# EAGLE design main w vias (EAGLE 9.5.0)
AUTHOR: Josh Castle/Kylie Fernandez; BOARD_NAME: Main Board; DOC_NUM: 1; PROJECT_NAME: Plantiful Care; REVISION: 1

## Sheet 1 of 3: Microcontroller
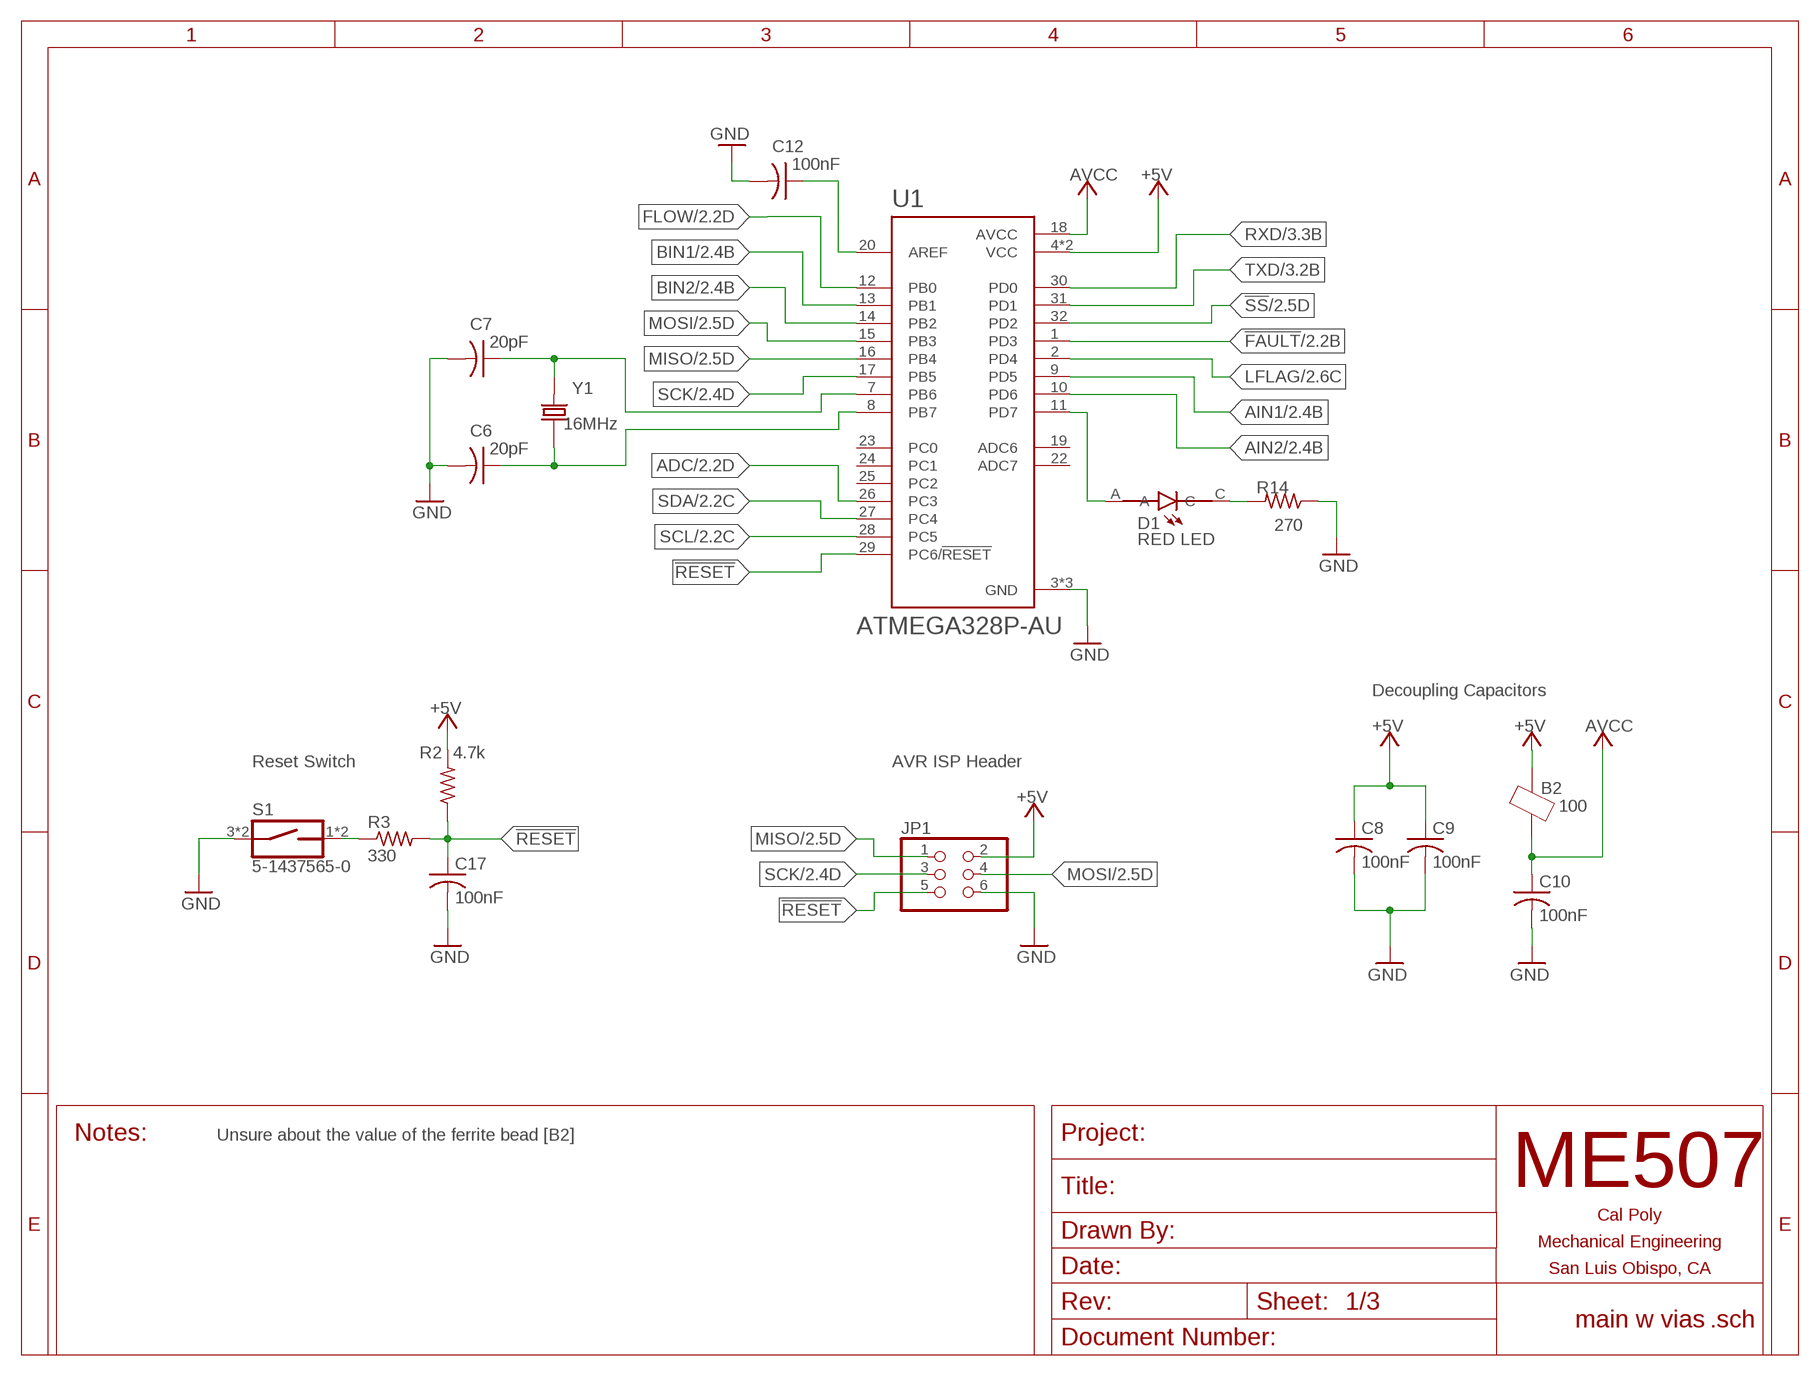
[diagram p0: schematic, sheet 1]

### Parts
B2  100  BEAD0805  [0805]
C6  20pF  C-USC0805  [C0805]
C7  20pF  C-USC0805  [C0805]
C8  100nF  C-USC0805  [C0805]
C9  100nF  C-USC0805  [C0805]
C10  100nF  C-USC0805  [C0805]
C12  100nF  C-USC0805  [C0805]
C17  100nF  C-USC0805  [C0805]
D1  RED LED  HSMC-C190  [LEDM1608X80]
JP1  PINHD-2X3  [2X03]
R2  4.7k  R-US_R0805  [R0805]
R3  330  R-US_R0805  [R0805]
R14  270  R-US_R0805  [R0805]
S1  5-1437565-0  [SW_5-1437565-0]
U1  ATMEGA328P-AU  [QFP80P900X900X120-32N]
Y1  16MHz  ECS-160-20-3X-TR  [XTAL_ECS-160-20-3X-TR]

### Nets
!FAULT!: U1.1(PD3) ; also sheet 2
!RESET!: C17.1 JP1.5 R2.1 R3.2 U1.29(PC6/!RESET)
!SS!: U1.32(PD2) ; also sheet 2
+5V: B2.2 C8.1 C9.1 JP1.2 R2.2 U1.4(VCC) U1.6(VCC) ; also sheet 2,3
ADC: U1.26(PC3) ; also sheet 2
AIN1: U1.9(PD5) ; also sheet 2
AIN2: U1.10(PD6) ; also sheet 2
AREF: C12.1 U1.20(AREF)
AVCC: B2.1 C10.1 U1.18(AVCC)
BIN1: U1.13(PB1) ; also sheet 2
BIN2: U1.14(PB2) ; also sheet 2
FLOW: U1.12(PB0) ; also sheet 2
GND: C6.2 C7.2 C8.2 C9.2 C10.2 C12.2 C17.2 JP1.6 R14.1 S1.3 S1.4 U1.3(GND) U1.5(GND) U1.21(GND) ; also sheet 2,3
LED: D1.C R14.2
LFLAG: U1.2(PD4) ; also sheet 2
MISO: JP1.1 U1.16(PB4) ; also sheet 2
MOSI: JP1.4 U1.15(PB3) ; also sheet 2
PD7: D1.A U1.11(PD7)
RXD: U1.30(PD0) ; also sheet 3
SCK: JP1.3 U1.17(PB5) ; also sheet 2
SCL: U1.28(PC5) ; also sheet 2
SDA: U1.27(PC4) ; also sheet 2
SW: R3.1 S1.1 S1.2
TOSC1: C7.1 U1.7(PB6) Y1.2
TOSC2: C6.1 U1.8(PB7) Y1.1
TXD: U1.31(PD1) ; also sheet 3
Unconnected: U1.19(ADC6) U1.22(ADC7) U1.23(PC0) U1.24(PC1) U1.25(PC2)

### Notes on the sheet
- Decoupling Capacitors
- Reset Switch | AVR ISP Header
- Unsure about the value of the ferrite bead [B2]

## Sheet 2 of 3: Motor Driver
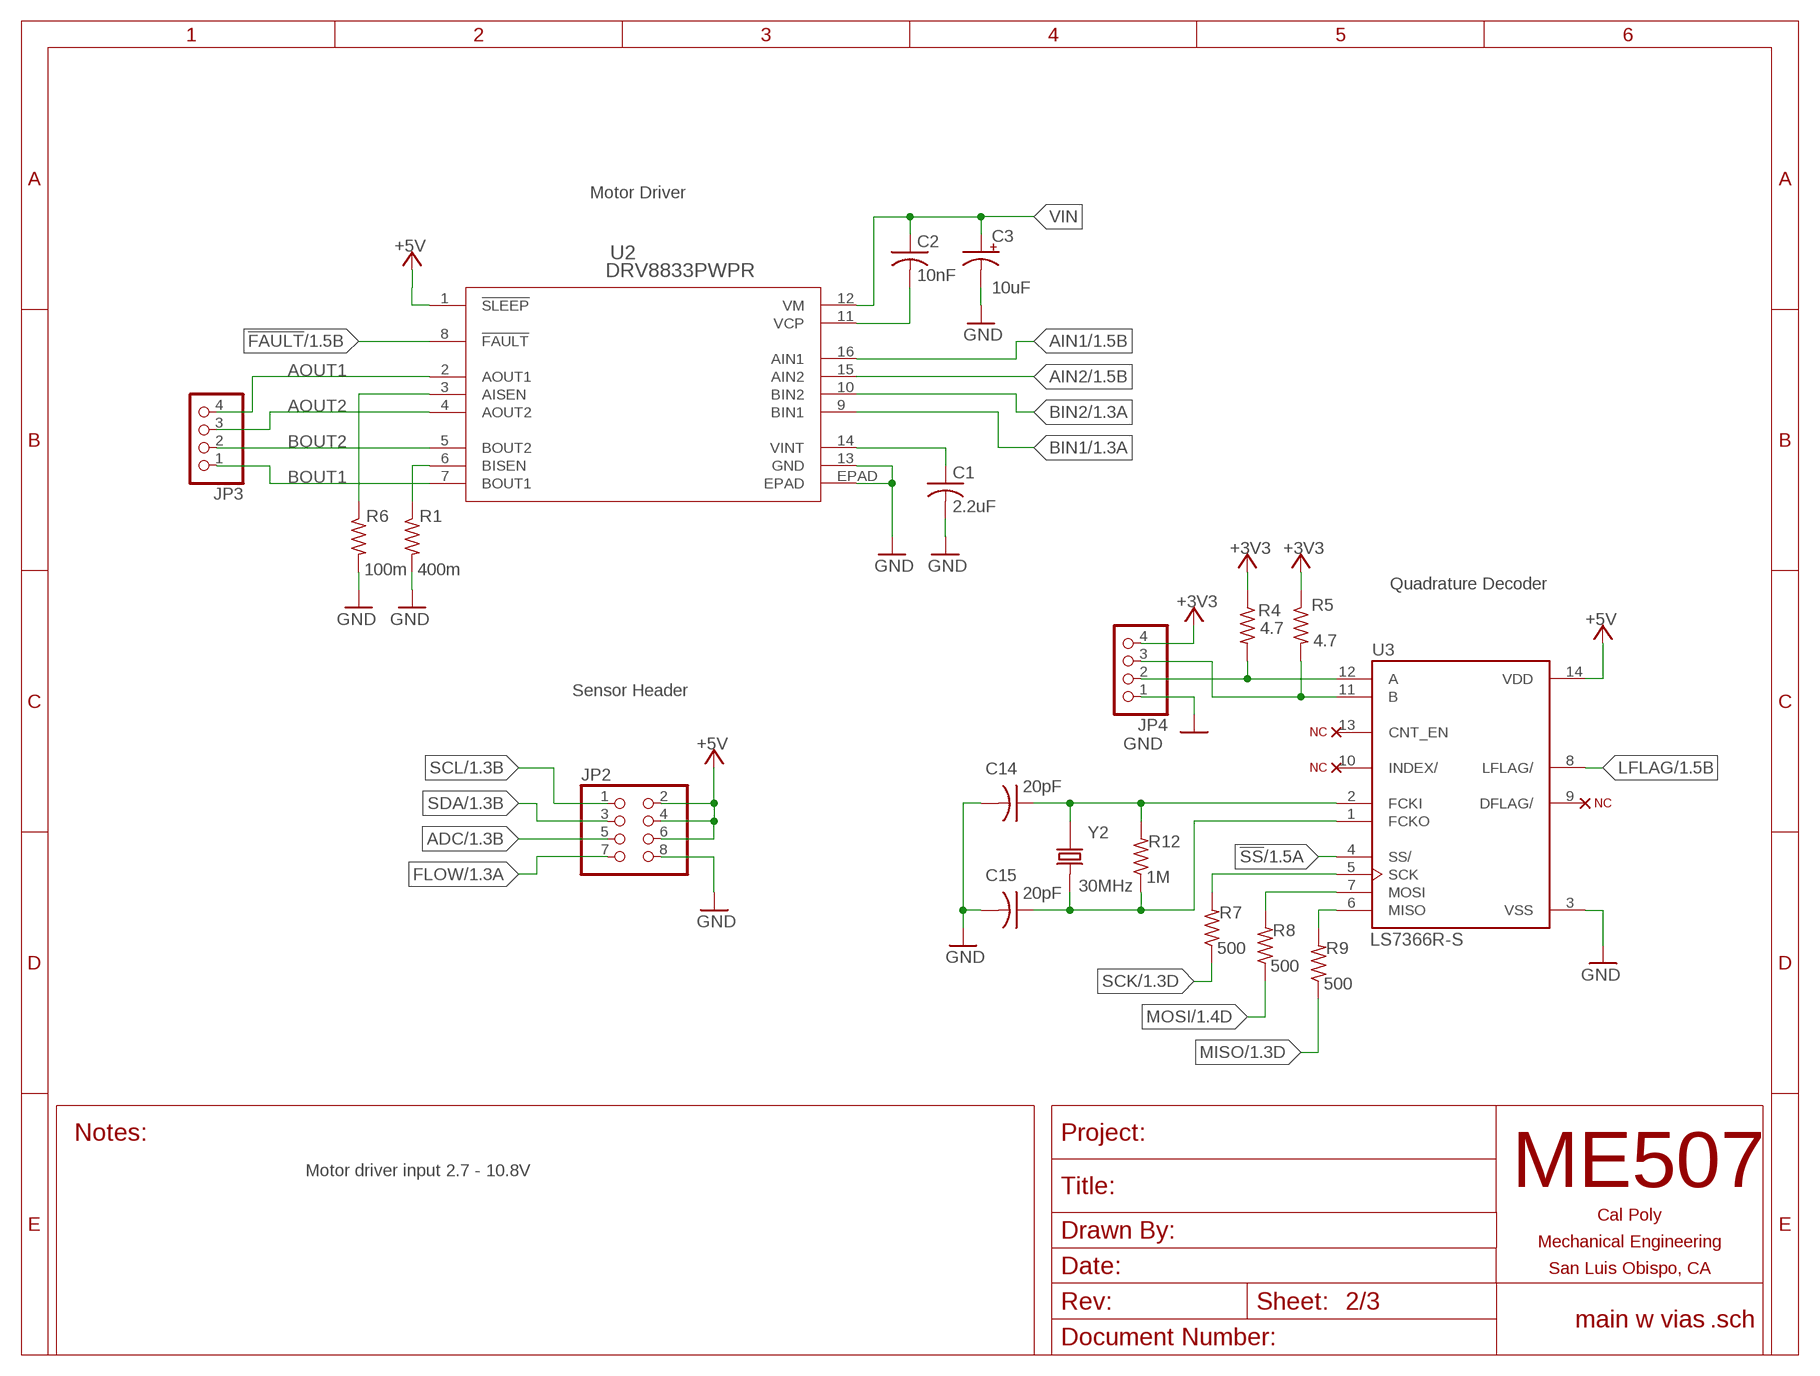
[diagram p1: schematic, sheet 2]

### Parts
C1  2.2uF  C-USC0805  [C0805]
C2  10nF  C-USC0805  [C0805]
C3  10uF  CPOL-USE5-4  [E5-4]
C14  20pF  C-USC0805  [C0805]
C15  20pF  C-USC0805  [C0805]
JP2  PINHD-2X4  [2X04]
JP3  PINHD-1X4  [1X04]
JP4  PINHD-1X4  [1X04]
R1  400m  R-US_R0805  [R0805]
R4  4.7  R-US_R0805  [R0805]
R5  4.7  R-US_R0805  [R0805]
R6  100m  R-US_R0805  [R0805]
R7  500  R-US_R0805  [R0805]
R8  500  R-US_R0805  [R0805]
R9  500  R-US_R0805  [R0805]
R12  1M  R-US_R0805  [R0805]
U2  DRV8833PWPR  [PWP16_2P31X2P46]
U3  LS7366R-S  LS7366R-TSLS7366R-S  [SOIC127P600X175-14N]
U$12  NC  (no package)
U$13  NC  (no package)
U$16  NC  (no package)
Y2  30MHz  ECS-160-20-3X-TR  [XTAL_ECS-160-20-3X-TR]

### Nets
!FAULT!: U2.8(!FAULT!) ; also sheet 1
!SS!: U3.4(SS/) ; also sheet 1
+3V3: JP4.4 R4.1 R5.1 ; also sheet 3
+5V: JP2.2 JP2.4 JP2.6 U2.1(!SLEEP!) U3.14(VDD) ; also sheet 1,3
ADC: JP2.5 ; also sheet 1
AIN1: U2.16(AIN1) ; also sheet 1
AIN2: U2.15(AIN2) ; also sheet 1
AISEN: R6.1 U2.3(AISEN)
AOUT1: JP3.4 U2.2(AOUT1)
AOUT2: JP3.3 U2.4(AOUT2)
BIN1: U2.9(BIN1) ; also sheet 1
BIN2: U2.10(BIN2) ; also sheet 1
BISEN: R1.1 U2.6(BISEN)
BOUT1: JP3.1 U2.7(BOUT1)
BOUT2: JP3.2 U2.5(BOUT2)
ENCA: JP4.2 R4.2 U3.12(A)
ENCB: JP4.3 R5.2 U3.11(B)
FCKI: C14.1 R12.2 U3.2(FCKI) Y2.1
FCKO: C15.1 R12.1 U3.1(FCKO) Y2.2
FLOW: JP2.7 ; also sheet 1
GND: C1.2 C3.- C14.2 C15.2 JP2.8 JP4.1 R1.2 R6.2 U2.13(GND) U2.EPAD U3.3(VSS) ; also sheet 1,3
LFLAG: U3.8(LFLAG/) ; also sheet 1
MI: R9.2 U3.6(MISO)
MISO: R9.1 ; also sheet 1
MO: R8.2 U3.7(MOSI)
MOSI: R8.1 ; also sheet 1
N$4: U3.13(CNT_EN) U$16.D
N$27: U3.10(INDEX/) U$12.D
N$28: U3.9(DFLAG/) U$13.D
SCK: R7.1 ; also sheet 1
SCL: JP2.1 ; also sheet 1
SCLK: R7.2 U3.5(SCK)
SDA: JP2.3 ; also sheet 1
VCP: C2.2 U2.11(VCP)
VIN: C2.1 C3.+ U2.12(VM) ; also sheet 3
VINT: C1.1 U2.14(VINT)

### Notes on the sheet
- Motor Driver
- Quadrature Decoder
- Sensor Header
- Motor driver input 2.7 - 10.8V

## Sheet 3 of 3: USB to UART
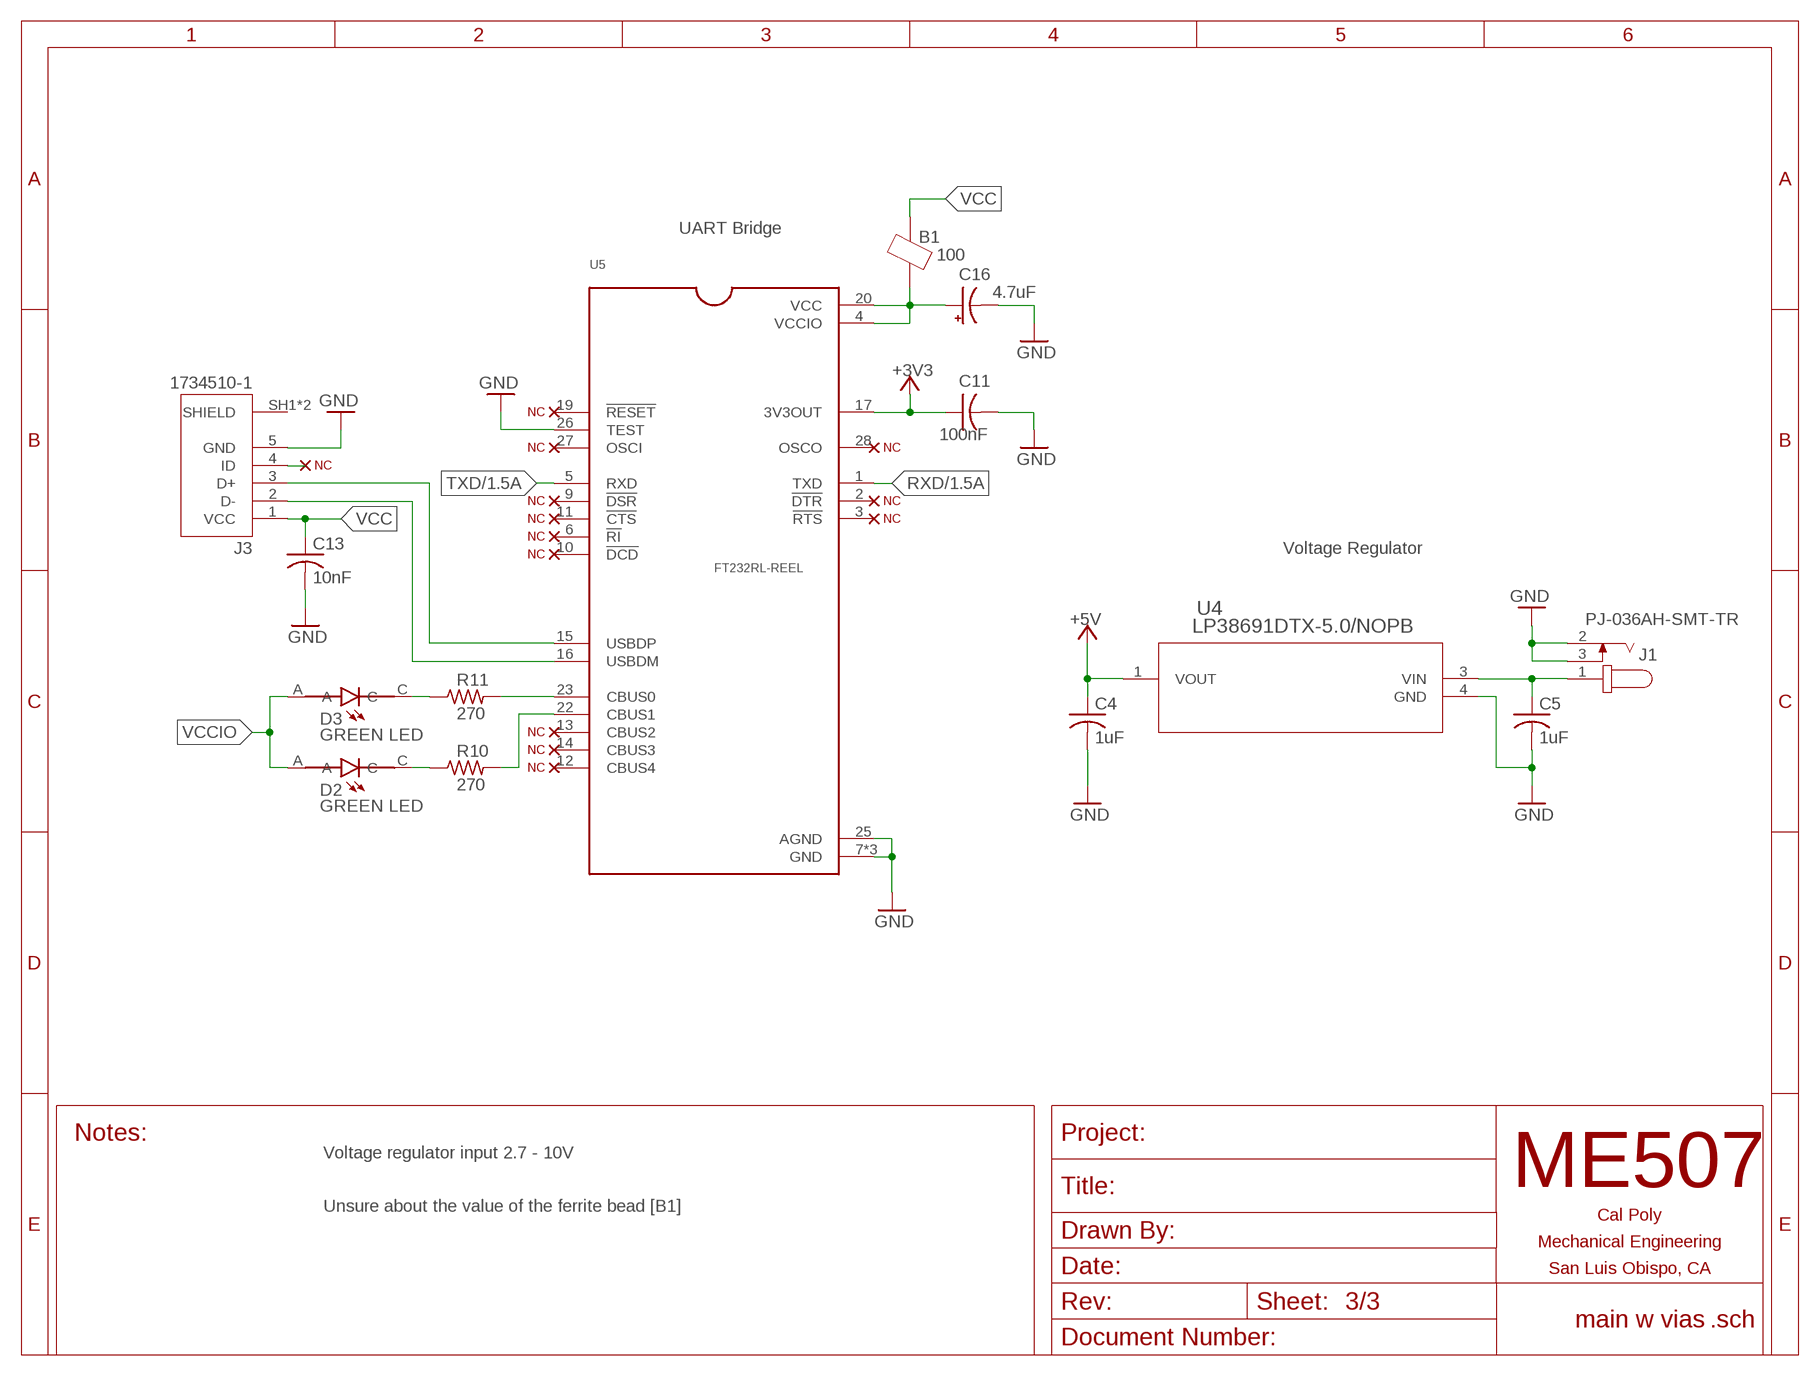
[diagram p2: schematic, sheet 3]

### Parts
B1  100  BEAD0805  [0805]
C4  1uF  C-USC0805  [C0805]
C5  1uF  C-USC0805  [C0805]
C11  100nF  C-USC0805  [C0805]
C13  10nF  C-USC0805  [C0805]
C16  4.7uF  CPOL-USE5-5  [E5-5]
D2  GREEN LED  HSMC-C190  [LEDM1608X80]
D3  GREEN LED  HSMC-C190  [LEDM1608X80]
J1  PJ-036AH-SMT-TR  [CUI_PJ-036AH-SMT-TR]
J3  1734510-1  [TE_1734510-1]
R10  270  R-US_R0805  [R0805]
R11  270  R-US_R0805  [R0805]
U4  LP38691DTX-5.0/NOPB  [TD03B]
U5  FT232RL-REEL  [SOP65P780X200-28N]
U$1  NC  (no package)
U$2  NC  (no package)
U$3  NC  (no package)
U$4  NC  (no package)
U$5  NC  (no package)
U$6  NC  (no package)
U$7  NC  (no package)
U$8  NC  (no package)
U$9  NC  (no package)
U$10  NC  (no package)
U$11  NC  (no package)
U$14  NC  (no package)
U$15  NC  (no package)

### Nets
+3V3: C11.1 U5.17(3V3OUT) ; also sheet 2
+5V: C4.1 U4.1(VOUT) ; also sheet 1,2
BUS0: R11.2 U5.23(CBUS0)
BUS1: R10.2 U5.22(CBUS1)
DM: J3.2(D-) U5.16(USBDM)
DP: J3.3(D+) U5.15(USBDP)
GND: C4.2 C5.2 C11.2 C13.2 C16.- J1.2 J1.3 J3.5(GND) U4.4(GND) U5.7(GND) U5.18(GND) U5.21(GND) U5.25(AGND) U5.26(TEST) ; also sheet 1,2
N$2: U5.3(!RTS) U$14.D
N$3: U5.11(!CTS) U$15.D
N$12: J3.4(ID) U$1.D
N$16: U5.27(OSCI) U$2.D
N$17: U5.28(OSCO) U$3.D
N$18: U5.19(!RESET) U$4.D
N$20: U5.9(!DSR) U$5.D
N$21: U5.6(!RI) U$6.D
N$22: U5.10(!DCD) U$7.D
N$23: U5.2(!DTR) U$8.D
N$24: U5.13(CBUS2) U$9.D
N$25: U5.14(CBUS3) U$10.D
N$26: U5.12(CBUS4) U$11.D
RXD: U5.1(TXD) ; also sheet 1
RXLED: D2.C R10.1
TXD: U5.5(RXD) ; also sheet 1
TXLED: D3.C R11.1
VCC: B1.2 C13.1 J3.1(VCC)
VCCIO: B1.1 C16.+ D2.A D3.A U5.4(VCCIO) U5.20(VCC)
VIN: C5.1 J1.1 U4.3(VIN) ; also sheet 2
Unconnected: J3.SH1(SHIELD) J3.SH2(SHIELD)

### Notes on the sheet
- UART Bridge
- Voltage Regulator
- Voltage regulator input 2.7 - 10V
- Unsure about the value of the ferrite bead [B1]

## Library data of the parts
B1 B2 = ME507:BEAD: Ferrite Bead
C1 C2 C4-C15 C17 = rcl:C-US: CAPACITOR, American symbol; SPICEPREFIX: C
C3 C16 = rcl:CPOL-US: POLARIZED CAPACITOR, American symbol; SPICEPREFIX: C
D1-D3 = HSMC-C190:HSMC-C190: LED, SMD, RED; DESCRIPTION: LED; SMD; 0603; red; 28.5-90mcd; 1.6x0.8x0.8mm; 170°; 1.9÷2.4V; 20mA; DIGI-KEY_PART_NUMBER: 516-1421-1-ND; DIGI-KEY_PURCHASE_URL: https://www.digikey.com/product-detail/en/broadcom-limited/HSMC-C190/516-1421-1-ND/637745?utm_source=snapeda&utm_medium=aggregator&utm_campaign=symbol; MF: Broadcom Limited; MP: HSMC-C190; PACKAGE: 0603 Broadcom
J1 = Downloads:PJ-036AH-SMT-TR: 2.0 mm Center Pin, 5.0 A, Right Angle, Surface Mount (SMT), Dc Power Jack Connector; CUI_PURCHASE_URL: https://www.cuidevices.com/product/interconnect/connectors/dc-power-connectors/jacks/pj-036ah-smt-tr?utm_source=snapeda.com&utm_medium=referral&utm_campaign=snapedaBOM; DESCRIPTION: 2.0 x 6.3 mm, 5.0 A, Horizontal, Surface Mount _SMT_, Dc Power Jack Connector; DIGI-KEY_PART_NUMBER: CP-036AHPJCT-ND; DIGI-KEY_PURCHASE_URL: https://www.digikey.com/product-detail/en/cui-devices/PJ-036AH-SMT-TR/CP-036AHPJCT-ND/1530994?utm_source=snapeda&utm_medium=aggregator&utm_campaign=symbol; MF: CUI Devices; MP: PJ-036AH-SMT-TR; PACKAGE: None
J3 = Downloads:1734510-1: Conn Mini USB Type B RCP 5 POS 1.6mm Solder RA Thru-Hole 5 Terminal 1 Port Tray; COMMENT: 1734510-1; DESCRIPTION: Conn Mini USB Type B RCP 5 POS 1.6mm Solder RA Thru-Hole 5 Terminal 1 Port Tray; DIGI-KEY_PART_NUMBER: A107788-ND; DIGI-KEY_PURCHASE_URL: https://www.digikey.com/product-detail/en/te-connectivity-amp-connectors/1734510-1/A107788-ND/4021669?utm_source=snapeda&utm_medium=aggregator&utm_campaign=symbol; MF: TE Connectivity; MP: 1734510-1; PACKAGE: None; TE_PURCHASE_URL: https://www.te.com/usa-en/product-1734510-1.html?te_bu=Cor&te_type=disp&te_campaign=seda_glo_cor-seda-global-disp-prtnr-fy19-seda-model-bom-cta_sma-317_1&elqCampaignId=32493
JP1 = pinhead:PINHD-2X3: PIN HEADER
JP2 = Downloads:PINHD-2X4: PIN HEADER
JP3 JP4 = Downloads:PINHD-1X4: PIN HEADER
R1-R12 R14 = rcl:R-US_: RESISTOR, American symbol; SPICEPREFIX: R
S1 = Downloads:5-1437565-0: Switch Tactile OFF (ON) Round Button Gull Wing 0.05A 12VDC 1.57N SMD T/R; COMMENT: 5-1437565-0; DESCRIPTION: Switch Push Button N.O. SPST Round Button 0.05A 12VDC 1VA Alternate Contact Gull Wing SMD T/R; DIGI-KEY_PART_NUMBER: 450-2058-1-ND; DIGI-KEY_PURCHASE_URL: https://www.digikey.com/product-detail/en/te-connectivity-alcoswitch-switches/FSM6JSMATR/450-2058-1-ND/4569748?utm_source=snapeda&utm_medium=aggregator&utm_campaign=symbol; MF: TE Connectivity; MP: FSM6JSMATR; PACKAGE: None; TE_PURCHASE_URL: https://www.te.com/usa-en/product-5-1437565-0.html?te_bu=Cor&te_type=disp&te_campaign=seda_glo_cor-seda-global-disp-prtnr-fy19-seda-model-bom-cta_sma-317_1&elqCampaignId=32493
U1 = Downloads:ATMEGA328P-AU: ATmega Series 20 MHz 32 KB Flash 2 KB SRAM 8-Bit Microcontroller - TQFP-32; DESCRIPTION: Microcontroller Mcu, 8 Bit, Atmega, 20mhz, Tqfp-32; DIGI-KEY_PART_NUMBER: ATMEGA328P-AU-ND; DIGI-KEY_PURCHASE_URL: https://www.digikey.com/product-detail/en/microchip-technology/ATMEGA328P-AU/ATMEGA328P-AU-ND/1832260?utm_source=snapeda&utm_medium=aggregator&utm_campaign=symbol; MF: Microchip; MP: ATMEGA328P-AU; PACKAGE: TQFP-32 Microchip
U2 = Downloads:DRV8833PWPR; MANUFACTURER_PART_NUMBER: DRV8833PWPR; VENDOR: Texas Instruments
U3 = Downloads:LS7366R-TS: 32-BIT QUADRATURE COUNTER WITH SERIAL INTERFACE
U4 = Downloads:LP38691DTX-5.0/NOPB; MANUFACTURER_PART_NUMBER: LP38691DTX5.0NOPB; VENDOR: Texas Instruments
U5 = Downloads:FT232RL-REEL: USB to serial UART interface; DESCRIPTION: USB Full Speed to Serial UART IC, Includes Oscillator and EEPROM - SSOP-28; DIGI-KEY_PART_NUMBER: 768-1007-1-ND; DIGI-KEY_PURCHASE_URL: https://www.digikey.com/product-detail/en/ftdi-future-technology-devices-international-ltd/FT232RL-REEL/768-1007-1-ND/1836402?utm_source=snapeda&utm_medium=aggregator&utm_campaign=symbol; MF: FTDI,; MP: FT232RL-REEL; PACKAGE: SSOP-28 FTDI
U$1-U$16 = ME507:NC
Y1 Y2 = Downloads:ECS-160-20-3X-TR: SMD QUARTZ CRYSTAL; DESCRIPTION: CSM-3X Series 16 MHz ±30 ppm 20 pF -10 to +70 °C Surface Mount Quartz Crystal; DIGI-KEY_PART_NUMBER: XC1776CT-ND; DIGI-KEY_PURCHASE_URL: https://www.digikey.com/product-detail/en/ecs-inc/ECS-160-20-3X-TR/XC1776CT-ND/2676640?utm_source=snapeda&utm_medium=aggregator&utm_campaign=symbol; MF: ECS Inc.; MP: ECS-160-20-3X-TR; PACKAGE: HC49/US ECS International

## Board
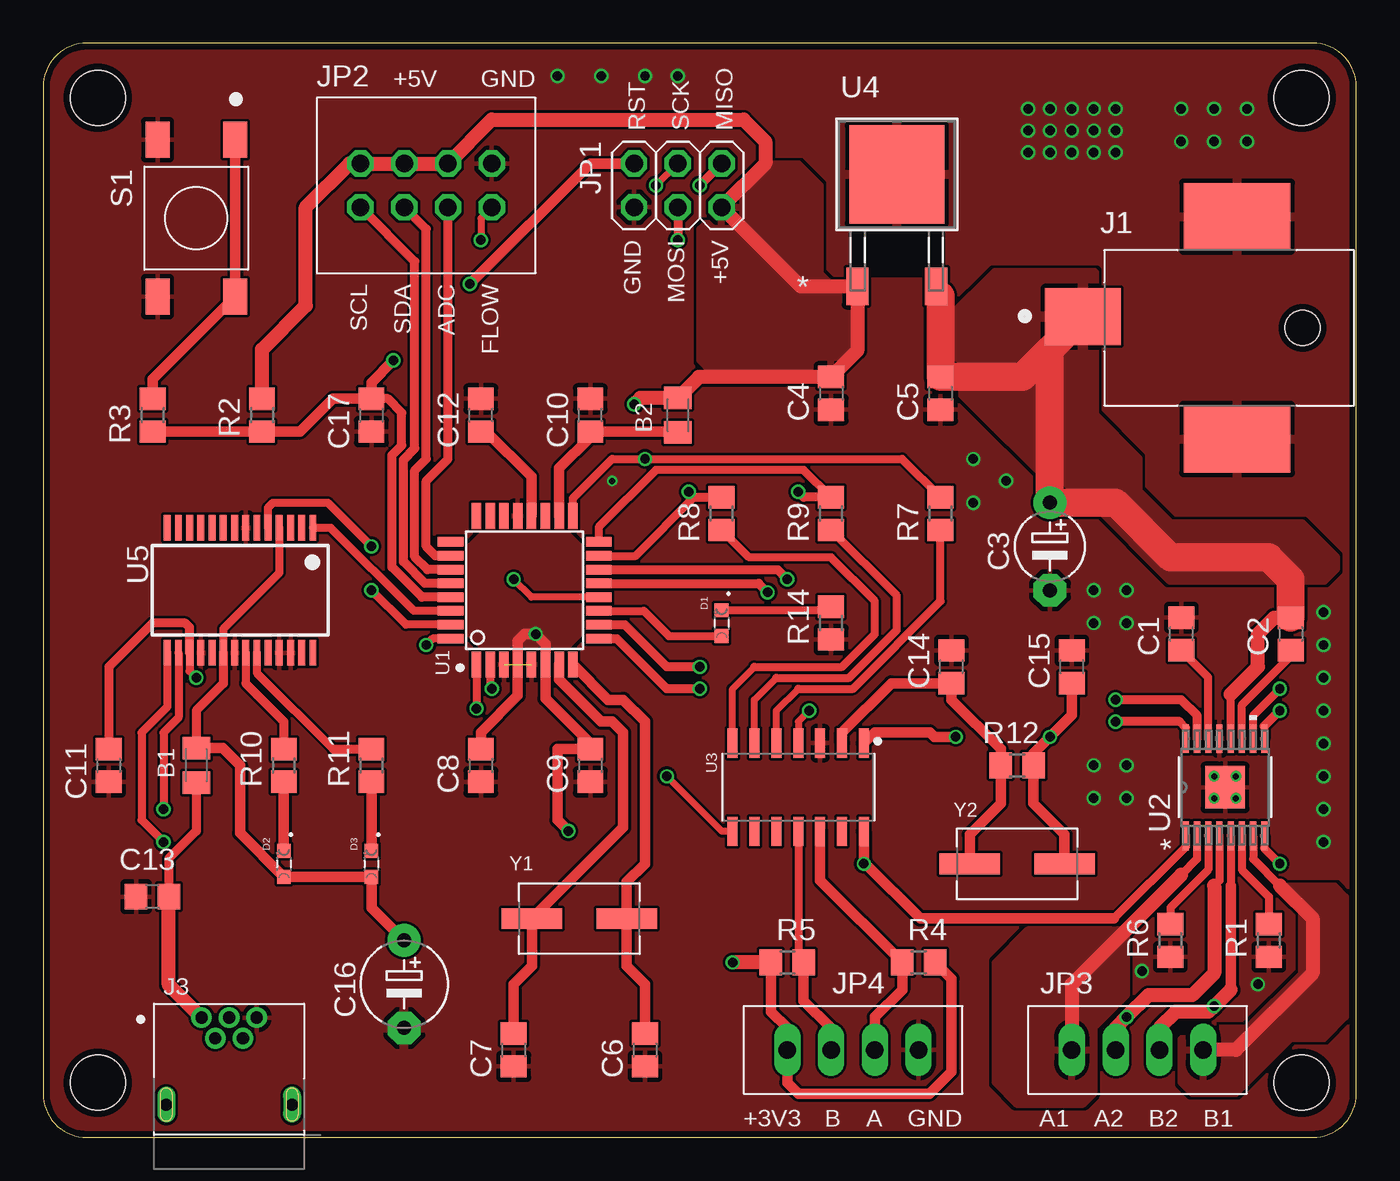
[diagram p3: board, top side]
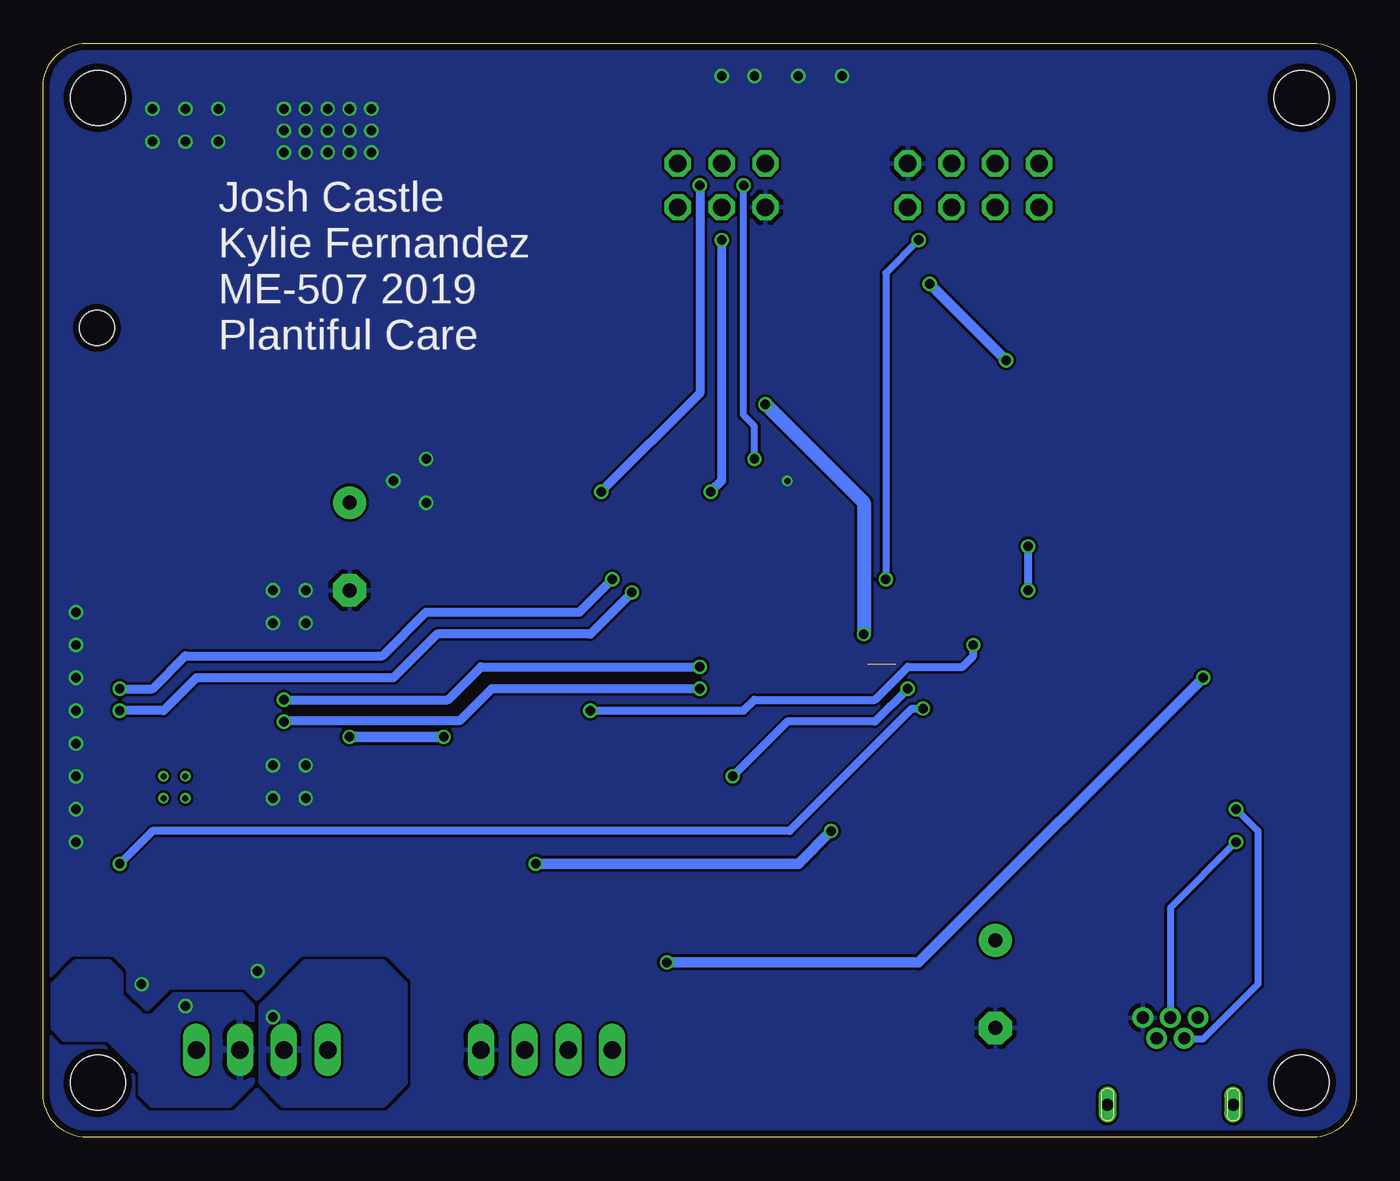
[diagram p4: board, bottom side, seen from below]

Size 76.2 x 63.5 mm. Coordinates in mm from the lower left corner, seen from the top.
Outline: 73.66,63.5 2.54,63.5 arc90 0,60.96 0,2.54 arc90 2.54,0 73.66,0 arc90 76.2,2.54 76.2,60.96 arc90 73.66,63.5
Copper layers (1*16): Top 0.035559375mm / dielectric 1.6mm / Bottom 0.035559375mm
Design rules "oshpark-2layer *": minimum track width 6mil, minimum drill 10mil, track to track 6mil, track to pad 6mil, pad to pad 6mil, via to via 6mil, smd to smd 6mil, copper to edge 15mil, drill to drill 6mil, minimum pad ring 5mil, minimum via ring 5mil, stop-mask expansion 2.5mil, vias tented up to drill 20mil, thermal gap 10mil
Holes 3.17 mm at 3.17,3.17 3.17,60.33 73.03,60.33 73.03,3.17

### Footprints (pad centres in the part's own frame; a part is rotated, then mirrored left to right if it is on the bottom)
0805 = smd 1.3 x 1.6: 1 -1,0; 2 1,0
C0805 = smd 1.3 x 1.5: 1 -0.95,0; 2 0.95,0
E5-4 = drill 0.813 pad 1.905: + -2.54,0 | drill 0.813 pad 1.905 octagon: - 2.54,0
E5-5 = drill 0.813 pad 1.905: + -2.54,0 | drill 0.813 pad 1.905 octagon: - 2.54,0
LEDM1608X80 = smd 0.8 x 0.8: A 0.75,0; C -0.75,0
CUI_PJ-036AH-SMT-TR = smd 4.4 x 3.3: 1 0,0 | smd 6.2 x 3.9: 2 -8.95,7.1; 3 -8.95,-5.8 | hole 2: -12.75,0.65
TE_1734510-1 = drill 0.7 pad 1.2: 1 -1.6,5.05; 2 -0.8,3.85; 3 0,5.05; 4 0.8,3.85; 5 1.6,5.05 | drill 0.7 long: SH1 3.65,0; SH2 -3.65,0
2X03 = drill 1.016 octagon: 1 -2.54,-1.27; 2 -2.54,1.27; 3 0,-1.27; 4 0,1.27; 5 2.54,-1.27; 6 2.54,1.27
2X04 = drill 1.016 octagon: 1 -3.81,-1.27; 2 -3.81,1.27; 3 -1.27,-1.27; 4 -1.27,1.27; 5 1.27,-1.27; 6 1.27,1.27; 7 3.81,-1.27; 8 3.81,1.27
1X04 = drill 1.016 long: 1 -3.81,0; 2 -1.27,0; 3 1.27,0; 4 3.81,0
R0805 = smd 1.3 x 1.5: 1 -0.95,0; 2 0.95,0
SW_5-1437565-0 = smd 2.1 x 1.4: 1 -4.55,2.25; 2 4.55,2.25; 3 -4.55,-2.25; 4 4.55,-2.25
QFP80P900X900X120-32N = smd 1.5 x 0.55: 1 -4.3,2.8; 2 -4.3,2; 3 -4.3,1.2; 4 -4.3,0.4; 5 -4.3,-0.4; 6 -4.3,-1.2; 7 -4.3,-2; 8 -4.3,-2.8; 17 4.3,-2.8; 18 4.3,-2; 19 4.3,-1.2; 20 4.3,-0.4; 21 4.3,0.4; 22 4.3,1.2; 23 4.3,2; 24 4.3,2.8 | smd 0.55 x 1.5: 9 -2.8,-4.3; 10 -2,-4.3; 11 -1.2,-4.3; 12 -0.4,-4.3; 13 0.4,-4.3; 14 1.2,-4.3; 15 2,-4.3; 16 2.8,-4.3; 25 2.8,4.3; 26 2,4.3; 27 1.2,4.3; 28 0.4,4.3; 29 -0.4,4.3; 30 -1.2,4.3; 31 -2,4.3; 32 -2.8,4.3
PWP16_2P31X2P46 = smd 1.676 x 0.356: 1 -2.819,2.275; 2 -2.819,1.625; 3 -2.819,0.975; 4 -2.819,0.325; 5 -2.819,-0.325; 6 -2.819,-0.975; 7 -2.819,-1.625; 8 -2.819,-2.275; 9 2.819,-2.275; 10 2.819,-1.625; 11 2.819,-0.975; 12 2.819,-0.325; 13 2.819,0.325; 14 2.819,0.975; 15 2.819,1.625; 16 2.819,2.275 | smd 2.46 x 2.31: EPAD 0,0 | drill 0.35: P$1 -0.635,0.635; P$2 0.635,0.635; P$3 0.635,-0.635; P$4 -0.635,-0.635
SOIC127P600X175-14N = smd 1.695 x 0.582: 1 -2.558,3.81; 2 -2.558,2.54; 3 -2.558,1.27; 4 -2.558,0; 5 -2.558,-1.27; 6 -2.558,-2.54; 7 -2.558,-3.81; 8 2.558,-3.81; 9 2.558,-2.54; 10 2.558,-1.27; 11 2.558,0; 12 2.558,1.27; 13 2.558,2.54; 14 2.558,3.81
TD03B = smd 1.295 x 2.159: 1 -2.285,-6.502; 3 2.285,-6.502 | smd 5.512 x 5.69: 4 0,0
SOP65P780X200-28N = smd 1.5 x 0.4: 1 -3.625,4.225; 2 -3.625,3.575; 3 -3.625,2.925; 4 -3.625,2.275; 5 -3.625,1.625; 6 -3.625,0.975; 7 -3.625,0.325; 8 -3.625,-0.325; 9 -3.625,-0.975; 10 -3.625,-1.625; 11 -3.625,-2.275; 12 -3.625,-2.925; 13 -3.625,-3.575; 14 -3.625,-4.225; 15 3.625,-4.225; 16 3.625,-3.575; 17 3.625,-2.925; 18 3.625,-2.275; 19 3.625,-1.625; 20 3.625,-0.975; 21 3.625,-0.325; 22 3.625,0.325; 23 3.625,0.975; 24 3.625,1.625; 25 3.625,2.275; 26 3.625,2.925; 27 3.625,3.575; 28 3.625,4.225
XTAL_ECS-160-20-3X-TR = smd 3.5 x 1.2: 1 -2.75,0; 2 2.75,0

### Placement (x,y rotation side)
B1  8.89,21.59 270 top
B2  36.83,41.91 90 top
C1  66.04,29.21 90 top
C2  72.39,29.21 270 top
C3  58.42,34.29 270 top
C4  45.72,43.18 270 top
C5  52.07,43.18 270 top
C6  34.92,5.08 270 top
C7  27.3,5.08 270 top
C8  25.4,21.59 270 top
C9  31.75,21.59 270 top
C10  31.75,41.91 90 top
C11  3.81,21.59 270 top
C12  25.4,41.91 90 top
C13  6.35,13.97 180 top
C14  52.7,27.3 90 top
C15  59.69,27.3 90 top
C16  20.95,8.89 270 top
C17  19.05,41.91 270 top
D1  39.37,29.84 270 top
D2  13.97,15.88 270 top
D3  19.05,15.88 270 top
J1  60.33,47.62 180 top
J3  10.79,1.91 0 top
JP1  36.83,55.24 180 top
JP2  22.23,55.24 0 top
JP3  63.5,5.08 180 top
JP4  46.99,5.08 180 top
R1  71.12,11.43 270 top
R2  12.7,41.91 90 top
R3  6.35,41.91 270 top
R4  50.8,10.16 180 top
R5  43.18,10.16 0 top
R6  65.41,11.43 270 top
R7  52.07,36.2 270 top
R8  39.37,36.2 270 top
R9  45.72,36.2 270 top
R10  13.97,21.59 90 top
R11  19.05,21.59 90 top
R12  56.52,21.59 180 top
R14  45.72,29.84 90 top
S1  8.89,53.34 270 top
U1  27.94,31.75 90 top
U2  68.58,20.32 90 top
U3  43.81,20.32 270 top
U4  49.53,55.88 0 top
U5  11.43,31.75 270 top
Y1  31.11,12.7 180 top
Y2  56.52,15.88 0 top

### Tracks (layer width: path | path; a pad name or v marks a point on that pad's centre or on a via)
!FAULT!  (via drill 0.55)
  Top 0.457: U2.8 70.86,16.77 v71.75,15.88 | U1.1 v25.14,24.9 v25.15,24.89
  Bottom 0.457: v25.15,24.89 25.78,24.89 32.89,17.78 69.85,17.78 v71.75,15.88
!RESET!  (via drill 0.55)
  Top 0.508: U1.29 21.99,31.35 20.24,33.1 20.24,39.59 20.81,40.15 20.81,42.06 20,42.86 C17.1
  Top 0.61: R3.2 R2.1 14.93,40.96 16.82,42.86 C17.1 19.05,43.81 v20.32,45.09 | v24.77,49.53 31.75,56.52 JP1.5
  Bottom 0.61: v20.32,45.09 v24.77,49.53
!SS!  (via drill 0.55)
  Top 0.406: v44.45,24.77 43.81,24.13 U3.4
  Top 0.457: U1.32 22.6,28.95 v22.23,28.57
  Bottom 0.457: v44.45,24.77 35.56,24.77 34.92,25.4 27.94,25.4 26.04,27.3 22.86,27.3 22.23,27.94 v22.23,28.57
+3V3  (via drill 0.55)
  Top 0.457: U5.17 8.51,27.05 v8.89,26.67
  Top 0.508: U5.17 8.51,29.59 8.26,29.84 6.35,29.84 3.81,27.3 C11.1
  Top 0.61: R5.1 42.23,7.3 43.18,6.35 JP4.4 43.18,3.17 43.81,2.54 51.44,2.54 52.7,3.81 52.7,9.21 R4.1
  Top 0.813: R5.1 v40.01,10.16
  Bottom 0.61: v8.89,26.67 25.4,10.16 v40.01,10.16
+5V  (via drill 0.55)
  Top 0.457: U2.1 66.31,16.87 62.14,12.7
  Top 0.61: C8.1 25.4,23.5 27.54,25.64 U1.4 27.54,28.81 27.94,29.21 v28.57,29.21 29.14,28.64 U1.6 29.14,25.47 31.75,22.86 C9.1 29.84,22.54 29.84,18.41 v30.48,17.78 | 62.14,12.7 50.89,12.7 47.72,15.88 v47.62,15.88 U3.14
  Top 0.813: R2.2 12.7,45.72 15.24,48.26 15.24,53.98 17.78,56.52 JP2.2 JP2.4 JP2.6 26.04,59.05 40.64,59.05 41.91,57.78 41.91,56.52 JP1.2 43.97,49.38 U4.1 47.24,45.66 C4.1 38.05,44.13 B2.2 34.66,42.91 v34.29,42.55
  Bottom 0.61: v30.48,17.78 32.38,15.88 v47.62,15.88
  Bottom 0.813: v34.29,42.55 28.57,36.83 v28.57,29.21
  pour Top: 27.3,34.92 25.4,34.92 24.77,34.29 24.77,29.21 25.4,28.57 30.48,28.57 31.11,29.21 31.11,34.29 30.48,34.92
  pour Top: 41.91,56.52 43.81,56.52 45.09,55.24 45.09,50.16 46.99,48.26 46.99,45.72 45.72,44.45 38.73,44.45 38.1,45.09 38.1,52.7
ADC
  Top 0.508: U1.26 22.77,33.75 22.23,34.29 22.23,38.1 23.5,39.37 JP2.5
AIN1  (via drill 0.55)
  Top 0.457: U2.16 66.31,23.77 65.95,24.13
  Top 0.508: U1.9 33.28,28.95 36.2,26.04 v38.1,26.04 | 65.95,24.13 v62.23,24.13
  Bottom 0.508: v38.1,26.04 50.16,26.04 51.99,24.21 62.15,24.21 v62.23,24.13
AIN2  (via drill 0.55)
  Top 0.508: U1.10 33.75,29.75 36.2,27.3 v38.1,27.3 | U2.15 66.95,24.48 66.04,25.4 v62.23,25.4
  Bottom 0.508: v62.23,25.4 52.7,25.4 50.8,27.3 v38.1,27.3
AISEN
  Top 0.457: U2.3 67.61,15.54 65.41,13.34 R6.1
AOUT1
  Top 0.457: U2.2 66.95,16.16 66.04,15.24
  Top 0.813: JP3.4 59.69,8.89 66.04,15.24
  pour Top: 62.87,12.06 62.87,8.26 60.96,6.35 60.96,2.54 60.33,1.91 56.52,1.91 55.24,3.17 55.24,10.16 57.15,12.06
AOUT2  (via drill 0.55)
  Top 0.457: U2.4 68.25,14.91 67.94,14.61
  Top 0.813: 67.94,14.61 67.94,9.53 66.67,8.26 64.14,8.26 v62.87,6.99 62.23,6.35 JP3.3
  pour Bottom: 63.5,3.17 63.5,7.62 60.96,10.16 56.52,10.16 55.24,8.89 55.24,3.17 56.52,1.91 62.23,1.91
AREF
  Top 0.61: U1.20 28.34,38.34 25.71,40.96 C12.1
AVCC
  Top 0.61: U1.18 29.94,38.83 31.75,40.64 C10.1 36.78,40.96 B2.1
BIN1  (via drill 0.55)
  Top 0.457: 70.86,23.86 U2.9
  Top 0.508: v71.75,24.77 70.86,23.86 | U1.13 41.51,32.15 v42.04,31.62
  Bottom 0.508: v71.75,24.77 69.22,24.77 67.31,26.67 55.88,26.67 53.34,29.21 44.45,29.21 v42.04,31.62
BIN2  (via drill 0.55)
  Top 0.457: U2.10 70.2,24.48 v71.75,26.04
  Top 0.508: U1.14 42.62,32.95 v43.18,32.38
  Bottom 0.508: v71.75,26.04 69.85,26.04 67.94,27.94 56.52,27.94 53.98,30.48 45.09,30.48 v43.18,32.38
BISEN
  Top 0.457: U2.6 69.56,15.54 71.12,13.97 R1.1
BOUT1
  Top 0.457: U2.7 70.2,16.16 71.75,14.61
  Top 0.813: 71.75,14.61 73.66,12.7 73.66,9.53 69.22,5.08 JP3.1
  pour Top: 71.75,14.61 74.93,14.61 75.56,13.97 75.56,6.99 74.3,5.71 72.39,5.71 69.22,2.54 66.67,2.54 66.04,3.17 66.04,5.71 66.67,6.35 69.85,6.35 73.03,9.53 73.03,13.34
BOUT2  (via drill 0.55)
  Top 0.457: U2.5 68.91,14.61
  Top 0.61: 68.91,14.61 68.91,8.58
  Top 0.813: JP3.2 64.77,6.35 65.71,7.29 67.61,7.29 v67.94,7.62 68.91,8.58
  pour Bottom: 64.14,7.62 64.14,3.17 65.41,1.91 69.85,1.91 70.48,2.54 70.48,3.81 72.39,5.71 74.93,5.71 75.56,6.35 75.56,8.89 74.3,10.16 72.39,10.16 71.75,9.53 71.75,8.26 70.48,6.99 69.85,6.99 68.58,8.26 64.77,8.26
BUS0
  Top 0.457: U5.23 12.4,26.96 16.83,22.54
  Top 0.508: 16.83,22.54 R11.2
BUS1
  Top 0.457: U5.22 11.76,26.34
  Top 0.508: R10.2 13.97,24.13 11.76,26.34
DM  (via drill 0.55)
  Top 0.457: U5.16 7.86,24.36 6.99,23.5 v6.99,19.05
  Bottom 0.406: v6.99,19.05 5.71,17.78 5.71,8.89 8.89,5.71 9.96,5.71 J3.2
DP  (via drill 0.55)
  Top 0.457: U5.15 7.21,24.98 5.71,23.5 5.71,18.41 v6.99,17.14
  Bottom 0.406: v6.99,17.14 10.79,13.34 J3.3
ENCA
  Top 0.61: JP4.2 48.26,6.99 49.85,8.57 R4.2 45.09,14.93 U3.12
ENCB
  Top 0.457: U3.11 43.81,10.47 R5.2
  Top 0.61: R5.2 44.13,7.94 45.72,6.35 JP4.3
FCKI
  Top 0.61: Y2.1 53.77,17.57 55.56,19.37 R12.2 55.56,22.54 52.7,25.4 C14.1 49.22,26.36 46.35,23.5 U3.2
FCKO  (via drill 0.55)
  Top 0.61: Y2.2 59.27,17.57 57.47,19.37 R12.1 57.47,22.29 v58.42,23.24 59.69,24.51 C15.1 | v52.96,23.24 51.73,23.24 51.45,23.51 48.26,23.51 U3.1
  Bottom 0.61: v58.42,23.24 v52.96,23.24
FLOW  (via drill 0.55)
  Top 0.406: JP2.7 25.4,53.34 v25.4,52.07 | U1.12 28.34,31.35 v27.3,32.38
  Bottom 0.406: v25.4,52.07 27.3,50.16 v27.3,32.38
GND  (via drill 0.35, 0.55)  (1 unrouted)
  other vias: 70.48,8.89 63.75,9.65 33.02,38.1 74.3,30.48 74.3,28.57 74.3,26.67 74.3,24.77 74.3,22.86 74.3,20.95 74.3,19.05 74.3,17.14 62.87,19.68 60.96,19.68 60.96,21.59 62.87,21.59 62.87,29.84 60.96,29.84 60.96,31.75 62.87,31.75 53.98,36.83 55.88,38.1 53.98,39.37 69.85,57.78 69.85,59.69 67.94,57.78 67.94,59.69 66.04,57.78 66.04,59.69 62.23,57.15 60.96,57.15 59.69,57.15 58.42,57.15 57.15,57.15 58.42,58.42 59.69,58.42 60.96,58.42 62.23,58.42 62.23,59.69 60.96,59.69 59.69,59.69 58.42,59.69 57.15,59.69 57.15,58.42 36.83,61.59 34.92,61.59 32.38,61.59 29.84,61.59
  pour Top (rank 4): -1.27,64.77 -1.27,-1.27 77.47,-1.27 77.47,64.77
  pour Bottom (rank 4): -2.54,66.04 -2.54,-2.54 78.74,-2.54 78.74,66.04
  pour Top (rank 2): 64.77,56.52 73.66,56.52 73.66,37.47 64.77,37.47
  pour Top (rank 2): 45.09,60.33 45.09,51.44 53.98,51.44 53.98,60.33
  pour Top: 19.05,8.26 19.05,4.45 22.86,4.45 22.86,8.26
LED
  Top 0.457: D1.C 45.52,30.59 R14.2
LFLAG  (via drill 0.55)
  Top 0.406: U3.8 39.39,17.76 v36.2,20.95
  Top 0.457: U1.2 25.94,26.13 v26.04,26.04
  Bottom 0.457: v36.2,20.95 33.02,24.13 27.94,24.13 v26.04,26.04
MI
  Top 0.406: U3.6 41.27,25.4 42.55,26.67
  Top 0.457: 42.55,26.67 46.76,26.67 49.53,29.44 49.53,31.43 R9.2
MISO  (via drill 0.55)
  Top 0.457: R9.1 44.13,38.73 35.56,38.73 32.24,35.41 U1.16
  Top 0.508: JP1.1 v38.1,55.24 | R9.1 44.13,37.15 v43.81,37.47
  Bottom 0.508: v38.1,55.24 38.1,43.18 v43.81,37.47
MO
  Top 0.406: U3.7 40.01,26.04 41.27,27.3
  Top 0.457: 41.27,27.3 46.35,27.3 48.26,29.21 48.26,31.11 45.72,33.66 40.96,33.66 R8.2
MOSI  (via drill 0.55)
  Top 0.457: U1.15 34.38,33.75 37.78,37.15 R8.1
  Top 0.508: JP1.4 v36.83,52.07 | v37.47,37.47 37.78,37.15 R8.1
  Bottom 0.508: v36.83,52.07 36.83,38.1 v37.47,37.47
PD7
  Top 0.457: U1.11 34.85,30.55 36.31,29.09 D1.A
RXD
  Top 0.457: U1.30 21.52,30.55 16.7,35.38 U5.1
RXLED
  Top 0.61: R10.1 D2.C
SCK  (via drill 0.55)
  Top 0.406: JP1.3 v35.56,55.24
  Top 0.457: U1.17 30.74,37.09 33.02,39.37 v34.92,39.37 49.84,39.37 R7.1
  Bottom 0.406: v34.92,39.37 34.92,41.27 35.56,41.91 v35.56,55.24
SCL
  Top 0.508: U1.28 22.16,32.15 20.9,33.41 20.9,39.32 21.57,39.98 21.57,50.83 JP2.1
SCLK
  Top 0.406: U3.5 42.55,24.77 43.81,26.04
  Top 0.457: 43.81,26.04 46.99,26.04 52.07,31.11 R7.2
SDA
  Top 0.508: U1.27 22.3,32.95 21.57,33.68 21.57,38.71 22.23,39.37 22.23,52.7 JP2.3
SW
  Top 0.61: S1.1 S1.2 6.35,44 R3.1
TOSC1
  Top 0.61: C7.1 27.3,8.89 28.36,9.95 Y1.2 33.66,17.99 33.66,23.5 33.02,24.13 32.38,24.13 29.94,26.57 U1.7
TOSC2
  Top 0.61: C6.1 34.92,8.89 33.87,9.95 Y1.1 33.87,14.81 34.92,15.88 34.92,24.13 33.66,25.4 32.79,25.4 U1.8
TXD  (via drill 0.55)
  Top 0.457: U1.31 21.05,29.75 v19.05,31.75 | U5.5 13.05,36.55 13.34,36.83 16.51,36.83 v19.05,34.29
  Bottom 0.457: v19.05,34.29 v19.05,31.75
TXLED
  Top 0.61: R11.1 D3.C
VCC
  Top 0.508: B1.2 8.89,17.78 7.3,16.19 C13.1
  Top 0.813: J3.1 7.3,8.85 C13.1
VCCIO
  Top 0.457: U5.4 13.71,32.76 10.46,29.5 10.46,27.94
  Top 0.508: U5.20 10.46,27.94 10.46,26.33 8.89,24.77 B1.1
  Top 0.61: C16.+ 19.05,13.34 D3.A D2.A 11.43,17.66 11.43,21.59 10.43,22.59 B1.1
VCP
  Top 0.457: U2.11 69.56,25.11 72.39,27.94 C2.2
VIN
  Top 0.457: U2.12 68.91,25.73
  Top 0.813: C2.1 71.44,30.16 70.48,29.21 70.48,27.3 68.91,25.73 | U4.3 52.07,49.12 52.07,48.84
  Top 1.626: C2.1 72.39,32.38 71.12,33.66 65.41,33.66 62.23,36.83 C3.+ 58.42,45.72 J1.1 56.83,44.13 C5.1 52.07,48.84
  pour Top: 60.96,50.16 60.96,41.91 63.5,39.37 63.5,37.47 65.41,35.56 73.03,35.56 74.93,33.66 74.93,33.02 74.3,32.38 65.41,32.38 60.96,36.83 59.69,36.83 52.7,43.81 52.7,47.62 55.24,50.16
VINT
  Top 0.457: U2.14 67.61,26.7 C1.1

### Text on the board
tNames: +5V | GND | RST | SCK | MISO | GND | MOSI | +5V | SCL | SDA | ADC | FLOW | +3V3 | B | A | GND | A1 | A2 | B2 | B1
bNames: Josh Castle / Kylie Fernandez / ME-507 2019 / Plantiful Care